# EAGLE schematic schematic (EAGLE 9.2.2)
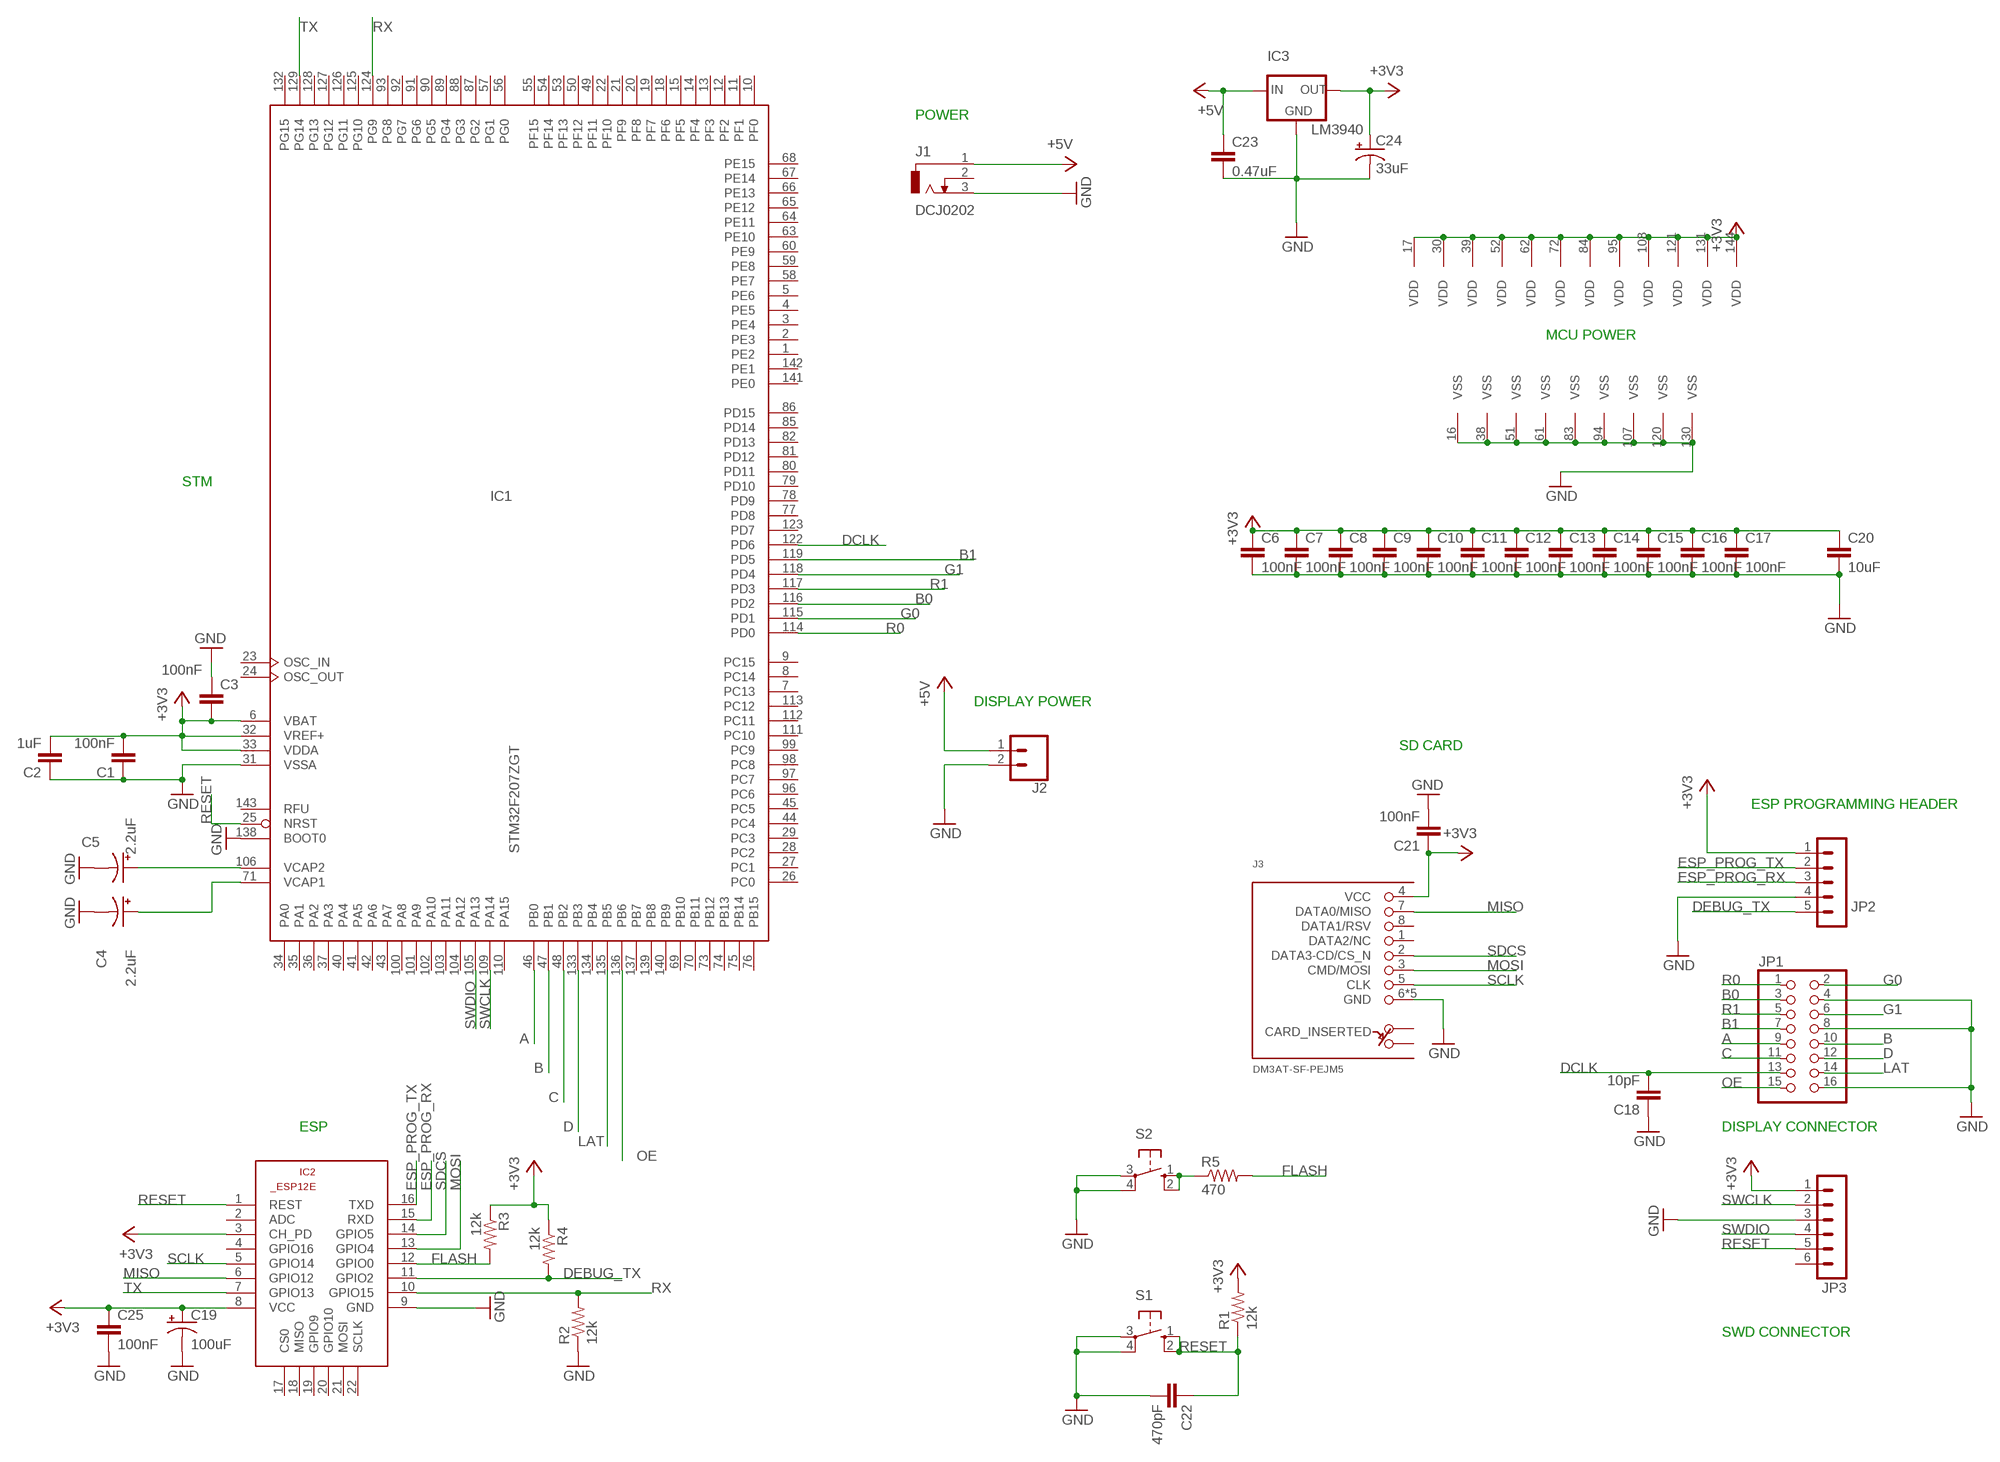
[diagram p0: schematic, sheet 1]

## Parts
C1  100nF  C-EU025-025X050  [C025-025X050]
C2  1uF  C-EU050-024X044  [C050-024X044]
C3  100nF  C-EU025-025X050  [C025-025X050]
C4  2.2uF  CPOL-USE1.8-4  [E1,8-4]
C5  2.2uF  CPOL-USE1.8-4  [E1,8-4]
C6  100nF  C-EU025-025X050  [C025-025X050]
C7  100nF  C-EU025-025X050  [C025-025X050]
C8  100nF  C-EU025-025X050  [C025-025X050]
C9  100nF  C-EU025-025X050  [C025-025X050]
C10  100nF  C-EU025-025X050  [C025-025X050]
C11  100nF  C-EU025-025X050  [C025-025X050]
C12  100nF  C-EU025-025X050  [C025-025X050]
C13  100nF  C-EU025-025X050  [C025-025X050]
C14  100nF  C-EU025-025X050  [C025-025X050]
C15  100nF  C-EU025-025X050  [C025-025X050]
C16  100nF  C-EU025-025X050  [C025-025X050]
C17  100nF  C-EU025-025X050  [C025-025X050]
C18  10pF  C-EU050-024X044  [C050-024X044]
C19  100uF  CPOL-USE2.5-6  [E2,5-6]
C20  10uF  C-EU025-025X050  [C025-025X050]
C21  100nF  C-EU025-025X050  [C025-025X050]
C22  470pF  C-EU025-025X050  [C025-025X050]
C23  0.47uF  C-EU050-024X044  [C050-024X044]
C24  33uF  CPOL-USE2-5  [E2-5]
C25  100nF  C-EU025-025X050  [C025-025X050]
IC1  STM32F207ZGT  [LQFP144]
IC2  ESP8266-12EESP12E  [ESP8266-ESP12E]
IC3  LM3940  [TO220]
J1  DCJ0202  [DCJ0202]
J2  CONN_025MM  [SCREWTERMINAL-5MM-2]
J3  DM3AT-SF-PEJM5  [DM3AT-SF-PEJM5]
JP1  PINHD-2X8  [2X08]
JP2  MA05-1  [MA05-1]
JP3  MA06-1  [MA06-1]
R1  12k  R-US_0204/7  [0204/7]
R2  12k  R-US_0204/7  [0204/7]
R3  12k  R-US_0204/7  [0204/7]
R4  12k  R-US_0204/7  [0204/7]
R5  470  R-US_0204/7  [0204/7]
S1  10-XX  [B3F-10XX]
S2  10-XX  [B3F-10XX]

## Nets
+3V3: C1.2 C2.2 C3.2 C6.1 C7.1 C8.1 C9.1 C10.1 C11.1 C12.1 C13.1 C14.1 C15.1 C16.1 C17.1 C19.+ C20.1 C21.1 C24.+ C25.1 IC1.6(VBAT) IC1.17(VDD) IC1.30(VDD) IC1.32(VREF+) IC1.33(VDDA) IC1.39(VDD) IC1.52(VDD) IC1.62(VDD) IC1.72(VDD) IC1.84(VDD) IC1.95(VDD) IC1.108(VDD) IC1.121(VDD) IC1.131(VDD) IC1.144(VDD) IC2.3(CH_PD) IC2.8(VCC) IC3.3(OUT) J3.4(VCC) JP2.1 JP3.1 R1.2 R3.1 R4.1
+5V: C23.1 IC3.1(IN) J1.1 J2.1
A: IC1.46(PB0) JP1.9
B: IC1.47(PB1) JP1.10
B0: IC1.116(PD2) JP1.3
B1: IC1.119(PD5) JP1.7
C: IC1.48(PB2) JP1.11
D: IC1.133(PB3) JP1.12
DCLK: C18.2 IC1.122(PD6) JP1.13
DEBUG_TX: IC2.11(GPIO2) JP2.5 R4.2
ESP_PROG_RX: IC2.15(RXD) JP2.3
ESP_PROG_TX: IC2.16(TXD) JP2.2
FLASH: IC2.12(GPIO0) R3.2 R5.2
G0: IC1.115(PD1) JP1.2
G1: IC1.118(PD4) JP1.6
GND: C1.1 C2.1 C3.1 C4.- C5.- C6.2 C7.2 C8.2 C9.2 C10.2 C11.2 C12.2 C13.2 C14.2 C15.2 C16.2 C17.2 C18.1 C19.- C20.2 C21.2 C22.2 C23.2 C24.- C25.2 IC1.16(VSS) IC1.31(VSSA) IC1.38(VSS) IC1.51(VSS) IC1.61(VSS) IC1.83(VSS) IC1.94(VSS) IC1.107(VSS) IC1.120(VSS) IC1.130(VSS) IC1.138(BOOT0) IC2.9(GND) IC3.2(GND) J1.3 J2.2 J3.6(GND) J3.MOUNT0(GND) J3.MOUNT1(GND) J3.MOUNT2(GND) J3.MOUNT3(GND) JP1.4 JP1.8 JP1.16 JP2.4 JP3.3 R2.1 S1.3(P) S1.4(P1) S2.3(P) S2.4(P1)
LAT: IC1.135(PB5) JP1.14
MISO: IC2.6(GPIO12) J3.7(DATA0/MISO)
MOSI: IC2.13(GPIO4) J3.3(CMD/MOSI)
N$1: R5.1 S2.1(S) S2.2(S1)
N$2: C5.+ IC1.106(VCAP2)
N$3: C4.+ IC1.71(VCAP1)
OE: IC1.136(PB6) JP1.15
R0: IC1.114(PD0) JP1.1
R1: IC1.117(PD3) JP1.5
RESET: C22.1 IC1.25(NRST) IC2.1(REST) JP3.5 R1.1 S1.1(S) S1.2(S1)
RX: IC1.124(PG9) IC2.10(GPIO15) R2.2
SCLK: IC2.5(GPIO14) J3.5(CLK)
SDCS: IC2.14(GPIO5) J3.2(DATA3-CD/CS_N)
SWCLK: IC1.109(PA14) JP3.2
SWDIO: IC1.105(PA13) JP3.4
TX: IC1.129(PG14) IC2.7(GPIO13)
Unconnected: IC1.1(PE2) IC1.2(PE3) IC1.3(PE4) IC1.4(PE5) IC1.5(PE6) IC1.7(PC13) IC1.8(PC14) IC1.9(PC15) IC1.10(PF0) IC1.11(PF1) IC1.12(PF2) IC1.13(PF3) IC1.14(PF4) IC1.15(PF5) IC1.18(PF6) IC1.19(PF7) IC1.20(PF8) IC1.21(PF9) IC1.22(PF10) IC1.23(OSC_IN) IC1.24(OSC_OUT) IC1.26(PC0) IC1.27(PC1) IC1.28(PC2) IC1.29(PC3) IC1.34(PA0) IC1.35(PA1) IC1.36(PA2) IC1.37(PA3) IC1.40(PA4) IC1.41(PA5) IC1.42(PA6) IC1.43(PA7) IC1.44(PC4) IC1.45(PC5) IC1.49(PF11) IC1.50(PF12) IC1.53(PF13) IC1.54(PF14) IC1.55(PF15) IC1.56(PG0) IC1.57(PG1) IC1.58(PE7) IC1.59(PE8) IC1.60(PE9) IC1.63(PE10) IC1.64(PE11) IC1.65(PE12) IC1.66(PE13) IC1.67(PE14) IC1.68(PE15) IC1.69(PB10) IC1.70(PB11) IC1.73(PB12) IC1.74(PB13) IC1.75(PB14) IC1.76(PB15) IC1.77(PD8) IC1.78(PD9) IC1.79(PD10) IC1.80(PD11) IC1.81(PD12) IC1.82(PD13) IC1.85(PD14) IC1.86(PD15) IC1.87(PG2) IC1.88(PG3) IC1.89(PG4) IC1.90(PG5) IC1.91(PG6) IC1.92(PG7) IC1.93(PG8) IC1.96(PC6) IC1.97(PC7) IC1.98(PC8) IC1.99(PC9) IC1.100(PA8) IC1.101(PA9) IC1.102(PA10) IC1.103(PA11) IC1.104(PA12) IC1.110(PA15) IC1.111(PC10) IC1.112(PC11) IC1.113(PC12) IC1.123(PD7) IC1.125(PG10) IC1.126(PG11) IC1.127(PG12) IC1.128(PG13) IC1.132(PG15) IC1.134(PB4) IC1.137(PB7) IC1.139(PB8) IC1.140(PB9) IC1.141(PE0) IC1.142(PE1) IC1.143(RFU) IC2.2(ADC) IC2.4(GPIO16) IC2.17(CS0) IC2.18(MISO) IC2.19(GPIO9) IC2.20(GPIO10) IC2.21(MOSI) IC2.22(SCLK) J1.2 J3.1(DATA2/NC) J3.8(DATA1/RSV) J3.A J3.B JP3.6

## Notes on the sheet
- POWER
- MCU POWER
- STM
- DISPLAY POWER
- SD CARD
- ESP PROGRAMMING HEADER
- ESP | DISPLAY CONNECTOR
- SWD CONNECTOR

## Library data of the parts
C1-C3 C6-C18 C20-C23 C25 = rcl:C-EU: CAPACITOR, European symbol; SPICEPREFIX: C
C4 C5 C19 C24 = rcl:CPOL-US: POLARIZED CAPACITOR, American symbol; SPICEPREFIX: C
IC1 = micro-stm_v3:STM32F207Z*T: ARM 32-bit Cortex™-M3 CPU 120 MHz maximum frequency 256 to 1024 Kbytes of Flash memory 128 kbytes of SRAM 114 GPIOs 1.8 to 3.6 V application supply
IC2 = esp12e:ESP8266-12E: ESP8266-12E Library for Eagle CAD The author not responsible for any damages or errors!. Created by Suhail jr.lt;/author>
IC3 = LM3940:LM3940: LM3940 1A Low Dropout Regulator for 5V to 3.3V Conversion; AVAILABILITY: Unavailable; MF: National Semiconductor; MP: LM3940; PACKAGE: None; PRICE: None
J1 = con-jack:DCJ0202: DC POWER JACK Source: DCJ0202.pdf; OC_FARNELL: unknown; OC_NEWARK: unknown
J2 = SparkFun-Connectors:CONN_02: Multi connection point. Often used as Generic Header-pin footprint for 0.1 inch spaced/style header connections On any of the 0.1 inch spaced packages, you can populate with these: Break Away Headers - Straight <https://www.sparkfun.com/products/116> (PRT-00116) Break Away Male Headers - Right Angle <https://www.sparkfun.com/products/553> (PRT-00553) Female Headers <https://www.sparkfun.com/products/115> (PRT-00115) Break Away Headers - Machine Pin <https://www.sparkfun.com/products/117> (PRT-00117) Break Away Female Headers - Swiss Machine Pin <https://www.sparkfun.com/products/743> (PRT-00743) For SCREWTERMINALS and SPRING TERMINALS visit here: Screw Terimnals on SparkFun.com <https://www.sparkfun.com/search/results?term=Screw+Terminals> (5mm/3.5mm/2.54mm spacing) This device is also useful as a general connection point to wire up your design to another part of your project. Our various solder wires solder well into these plated through hole pads. Hook-Up Wire - Assortment (Stranded, 22 AWG) <https://www.sparkfun.com/products/11375> (PRT-11375) Hook-Up Wire - Assortment (Solid Core, 22 AWG) <https://www.sparkfun.com/products/11367> (PRT-11367) View the entire wire category on our website here <https://www.sparkfun.com/categories/141> Special notes: Molex polarized connector foot print use with: PRT-08233 with associated crimp pins and housings. 2.54_SCREWTERM for use with PRT-10571. 3.5mm Screw Terminal footprints for PRT-08084 5mm Screw Terminal footprints for use with PRT-08432; SF_SKU: PRT-08432
J3 = connector:DM3AT-SF-PEJM5: CONN MICRO SD R/A PUSH-PUSH SMD; DESCRIPTION: CONN MICRO SD CARD PUSH-PUSH R/A; DIGIKEY: HR1964CT-ND; MANUFACTURER: Hirose Electric Co Ltd; MPN: DM3AT-SF-PEJM5
JP1 = pinhead:PINHD-2X8: PIN HEADER
JP2 = con-lstb:MA05-1: PIN HEADER; OC_FARNELL: unknown; OC_NEWARK: unknown
JP3 = con-lstb:MA06-1: PIN HEADER; OC_FARNELL: unknown; OC_NEWARK: unknown
R1-R5 = rcl:R-US_: RESISTOR, American symbol; SPICEPREFIX: R
S1 S2 = switch-omron:10-XX: OMRON SWITCH; MPN: B3F-1000; OC_FARNELL: 176432; OC_NEWARK: 36M3542